# Altium schematic sheet audio.SchDoc
size A4
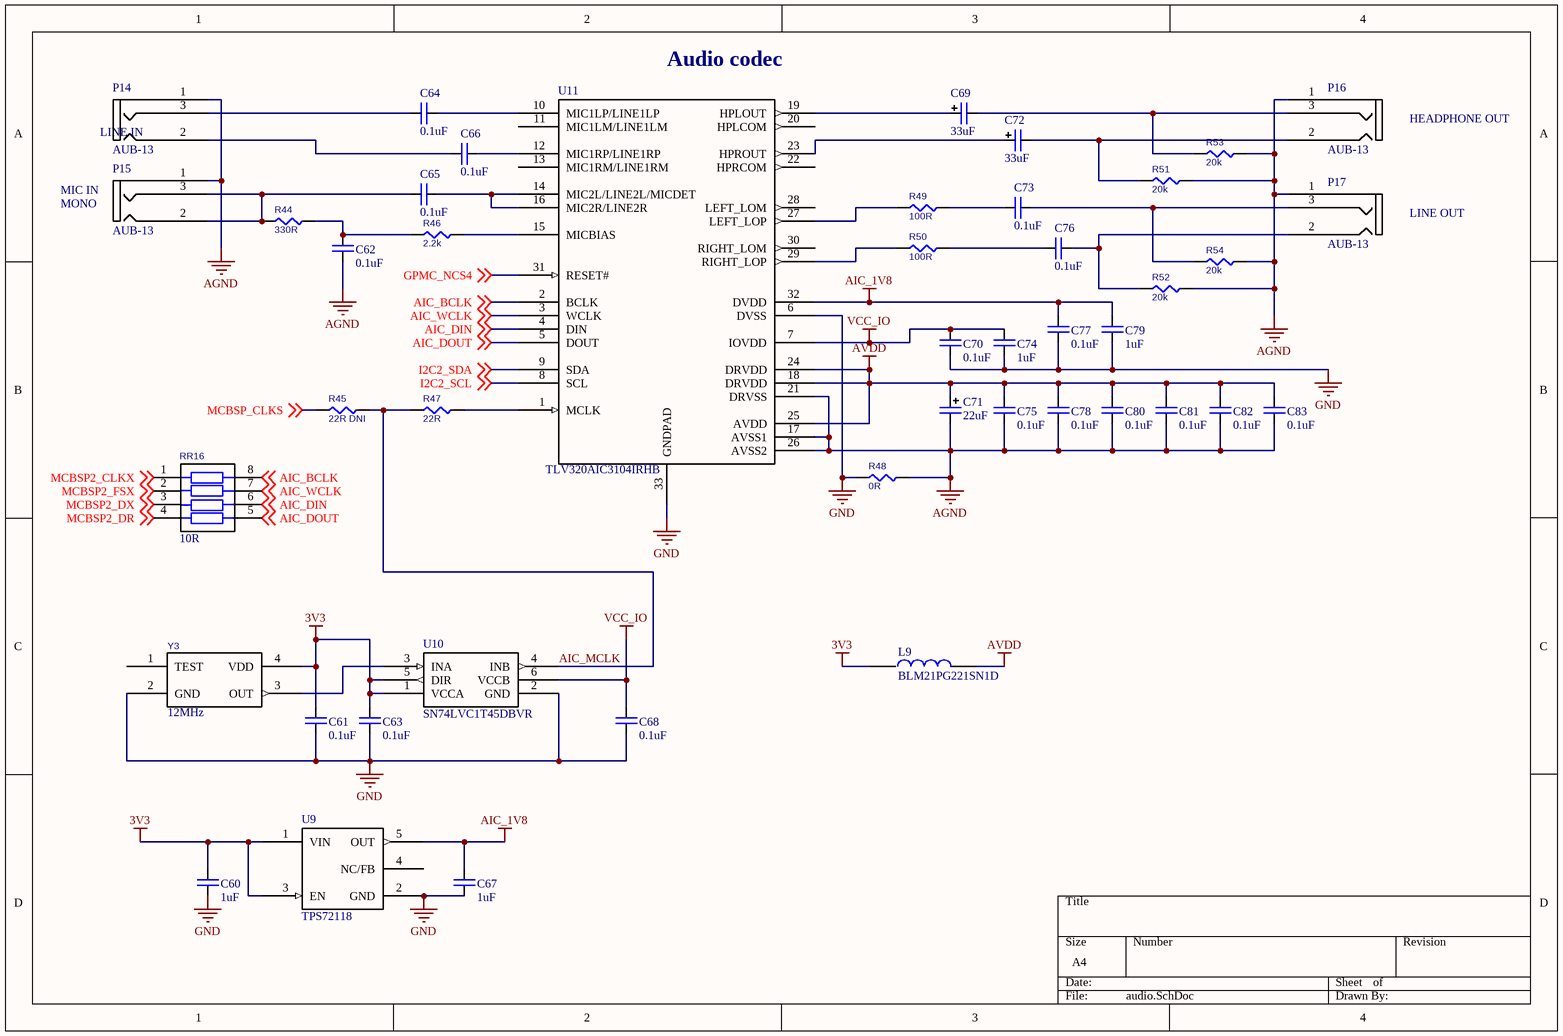
[diagram p0: audio.SchDoc]

## Parts
C60  value 1uF  [CHIP0603]  (hidden comment: C0603)
C61  value 0.1uF  [CHIP0603]  (hidden comment: C0603)
C62  value 0.1uF  [CHIP0603]  (hidden comment: C0603)
C63  value 0.1uF  [CHIP0603]  (hidden comment: C0603)
C64  value 0.1uF  [CHIP0603]  (hidden comment: C0603)
C65  value 0.1uF  [CHIP0603]  (hidden comment: C0603)
C66  value 0.1uF  [CHIP0603]  (hidden comment: C0603)
C67  value 1uF  [CHIP0603]  (hidden comment: C0603)
C68  value 0.1uF  [CHIP0603]  (hidden comment: C0603)
C69  value 33uF  [B]  (hidden comment: CAP B)
C70  value 0.1uF  [CHIP0603]  (hidden comment: C0603)
C71  value 22uF  [B]  (hidden comment: CAP B)
C72  value 33uF  [B]  (hidden comment: CAP B)
C73  value 0.1uF  [CHIP0603]  (hidden comment: C0603)
C74  value 1uF  [CHIP0603]  (hidden comment: C0603)
C75  value 0.1uF  [CHIP0603]  (hidden comment: C0603)
C76  value 0.1uF  [CHIP0603]  (hidden comment: C0603)
C77  value 0.1uF  [CHIP0603]  (hidden comment: C0603)
C78  value 0.1uF  [CHIP0603]  (hidden comment: C0603)
C79  value 1uF  [CHIP0603]  (hidden comment: C0603)
C80  value 0.1uF  [CHIP0603]  (hidden comment: C0603)
C81  value 0.1uF  [CHIP0603]  (hidden comment: C0603)
C82  value 0.1uF  [CHIP0603]  (hidden comment: C0603)
C83  value 0.1uF  [CHIP0603]  (hidden comment: C0603)
L9  BLM21PG221SN1D  [Chip2PinSM127P600-8N]
P14  AUB-13  [AUB_13]
P15  AUB-13  [AUB_13]
P16  AUB-13  [AUB_13]
P17  AUB-13  [AUB_13]
R44  value 330R  [CHIP0603]  (hidden comment: R0603)
R45  value 22R DNI  [CHIP0603]  (hidden comment: R0603)
R46  value 2.2k  [CHIP0603]  (hidden comment: R0603)
R47  value 22R  [CHIP0603]  (hidden comment: R0603)
R48  value 0R  [CHIP0603]  (hidden comment: R0603)
R49  value 100R  [CHIP0603]  (hidden comment: R0603)
R50  value 100R  [CHIP0603]  (hidden comment: R0603)
R51  value 20k  [CHIP0603]  (hidden comment: R0603)
R52  value 20k  [CHIP0603]  (hidden comment: R0603)
R53  value 20k  [CHIP0603]  (hidden comment: R0603)
R54  value 20k  [CHIP0603]  (hidden comment: R0603)
RR16  value 10R  [PACKAGE-J4]  (hidden comment: CAY-J4)
U9  TPS72118  [SOT23-5]
U10  SN74LVC1T45DBVR  [SOT95P280X145-6L]
U11  Man P/N: TLV320AIC3104IRHB  [QFN32]  (hidden comment: TLV320AIC3104)
Y3  value 12MHz  [KXO_V97]  (hidden comment: KXO-V97)

## Nets
3V3: C60.1 C61.1 C63.1 L9.1 U9.1(VIN) U9.3(EN) U10.1(VCCA) U10.5(DIR) Y3.4(VDD)
AGND: C62.1 C71.2 C75.2 C78.2 C80.2 C81.2 C82.2 C83.2 P14.1(GND) P15.1(GND) P16.1(GND) P17.1(GND) R48.2 R51.1 R52.1 R53.1 R54.1 U11.17(AVSS1) U11.21(DRVSS) U11.26(AVSS2)
AIC_1V8: C67.1 C77.1 C79.1 U9.5(OUT) U11.32(DVDD)
AVDD: C71.1 C75.1 C78.1 C80.1 C81.1 C82.1 C83.1 L9.2 U11.18(DRVDD) U11.24(DRVDD) U11.25(AVDD)
GND: C60.2 C61.2 C63.2 C67.2 C68.2 C70.2 C74.2 C77.2 C79.2 R48.1 U9.2(GND) U10.2(GND) U11.6(DVSS) U11.33(GNDPAD) Y3.2(GND)
VCC_IO: C68.1 C70.1 C74.1 U10.6(VCCB) U11.7(IOVDD)
AIC_BCLK: RR16.8 U11.2(BCLK) ; off-sheet AIC_BCLK
AIC_DIN: RR16.6 U11.4(DIN) ; off-sheet AIC_DIN
AIC_DOUT: RR16.5 U11.5(DOUT) ; off-sheet AIC_DOUT
AIC_MCLK: R45.2 R47.1 U10.4(INB)
AIC_WCLK: RR16.7 U11.3(WCLK) ; off-sheet AIC_WCLK
GPMC_NCS4: U11.31(RESET#) ; off-sheet GPMC_NCS4
I2C2_SCL: U11.8(SCL) ; off-sheet I2C2_SCL
I2C2_SDA: U11.9(SDA) ; off-sheet I2C2_SDA
MCBSP2_CLKX: RR16.1 ; off-sheet MCBSP2_CLKX
MCBSP2_DR: RR16.4 ; off-sheet MCBSP2_DR
MCBSP2_DX: RR16.3 ; off-sheet MCBSP2_DX
MCBSP2_FSX: RR16.2 ; off-sheet MCBSP2_FSX
MCBSP_CLKS: R45.1 ; off-sheet MCBSP_CLKS
NetC62_2: C62.2 R44.2 R46.1
NetC64_1: C64.1 P14.3(LEFT)
NetC64_2: C64.2 U11.10(MIC1LP/LINE1LP)
NetC65_1: C65.1 P15.2(RIGHT) P15.3(LEFT) R44.1
NetC65_2: C65.2 U11.14(MIC2L/LINE2L/MICDET) U11.16(MIC2R/LINE2R)
NetC66_1: C66.1 P14.2(RIGHT)
NetC66_2: C66.2 U11.12(MIC1RP/LINE1RP)
NetC69_1: C69.1 U11.19(HPLOUT)
NetC69_2: C69.2 P16.3(LEFT) R53.2
NetC72_1: C72.1 U11.23(HPROUT)
NetC72_2: C72.2 P16.2(RIGHT) R51.2
NetC73_1: C73.1 R49.2
NetC73_2: C73.2 P17.3(LEFT) R54.2
NetC76_1: C76.1 R50.2
NetC76_2: C76.2 P17.2(RIGHT) R52.2
NetR46_2: R46.2 U11.15(MICBIAS)
NetR47_2: R47.2 U11.1(MCLK)
NetR49_1: R49.1 U11.27(LEFT_LOP)
NetR50_1: R50.1 U11.29(RIGHT_LOP)
NetU10_3: U10.3(INA) Y3.3(OUT)

Not connected (* = marked no-connect by the designer): U9 4(NC/FB); U11 11(MIC1LM/LINE1LM) 13(MIC1RM/LINE1RM) 20(HPLCOM) 22(HPRCOM) 28(LEFT_LOM) 30(RIGHT_LOM); Y3 1(TEST)

## Notes on the sheet
- (near U11) Audio codec
- LINE IN
- HEADPHONE OUT
- MIC IN
  MONO
- LINE OUT

## Library data of the parts
C60-C68 C70 C73-C83 = C0603: Ceramic capacitor C0603
C69 C71 C72 = CAP B: Tantalum capacitor. Case B
L9 = BLM21PG221SN1D: Manufacturer: Murata; Man P/N: BLM21PG221SN1D
P14-P17 = AUB-13: Audio connector mini-jack 3.5mm, 3 pins; Vendor: brownbear.ru
R44-R54 = R0603: Resistor 0603
RR16 = CAY-J4: Resistor network 4x
U9 = TPS72118: LOW INPUT VOLTAGE, CAP FREE 150-mA; Manufacturer: TI; Man P/N: TPS72118DBV; Man 2 P/N: NCP699SN18
U10 = SN74LVC1T45: Single-Bit Dual-Supply Bus Transceiver; Manufacturer: Texas Instruments; URL: http://focus.ti.com/docs/prod/folders/print/sn74lvc1t45.html; Man P/N: SN74LVC1T45DBVR
U11 = TLV320AIC3104: LOW-POWER STEREO AUDIO CODEC FOR PORTABLE AUDIO/TELEPHONY; Manufacturer: TI
Y3 = KXO-V97: Quartz oscillator 7x5mm; Manufacturer: Geyer; Man P/N: KXO-V97